# Altium project Clock_PCB.PrjPcb
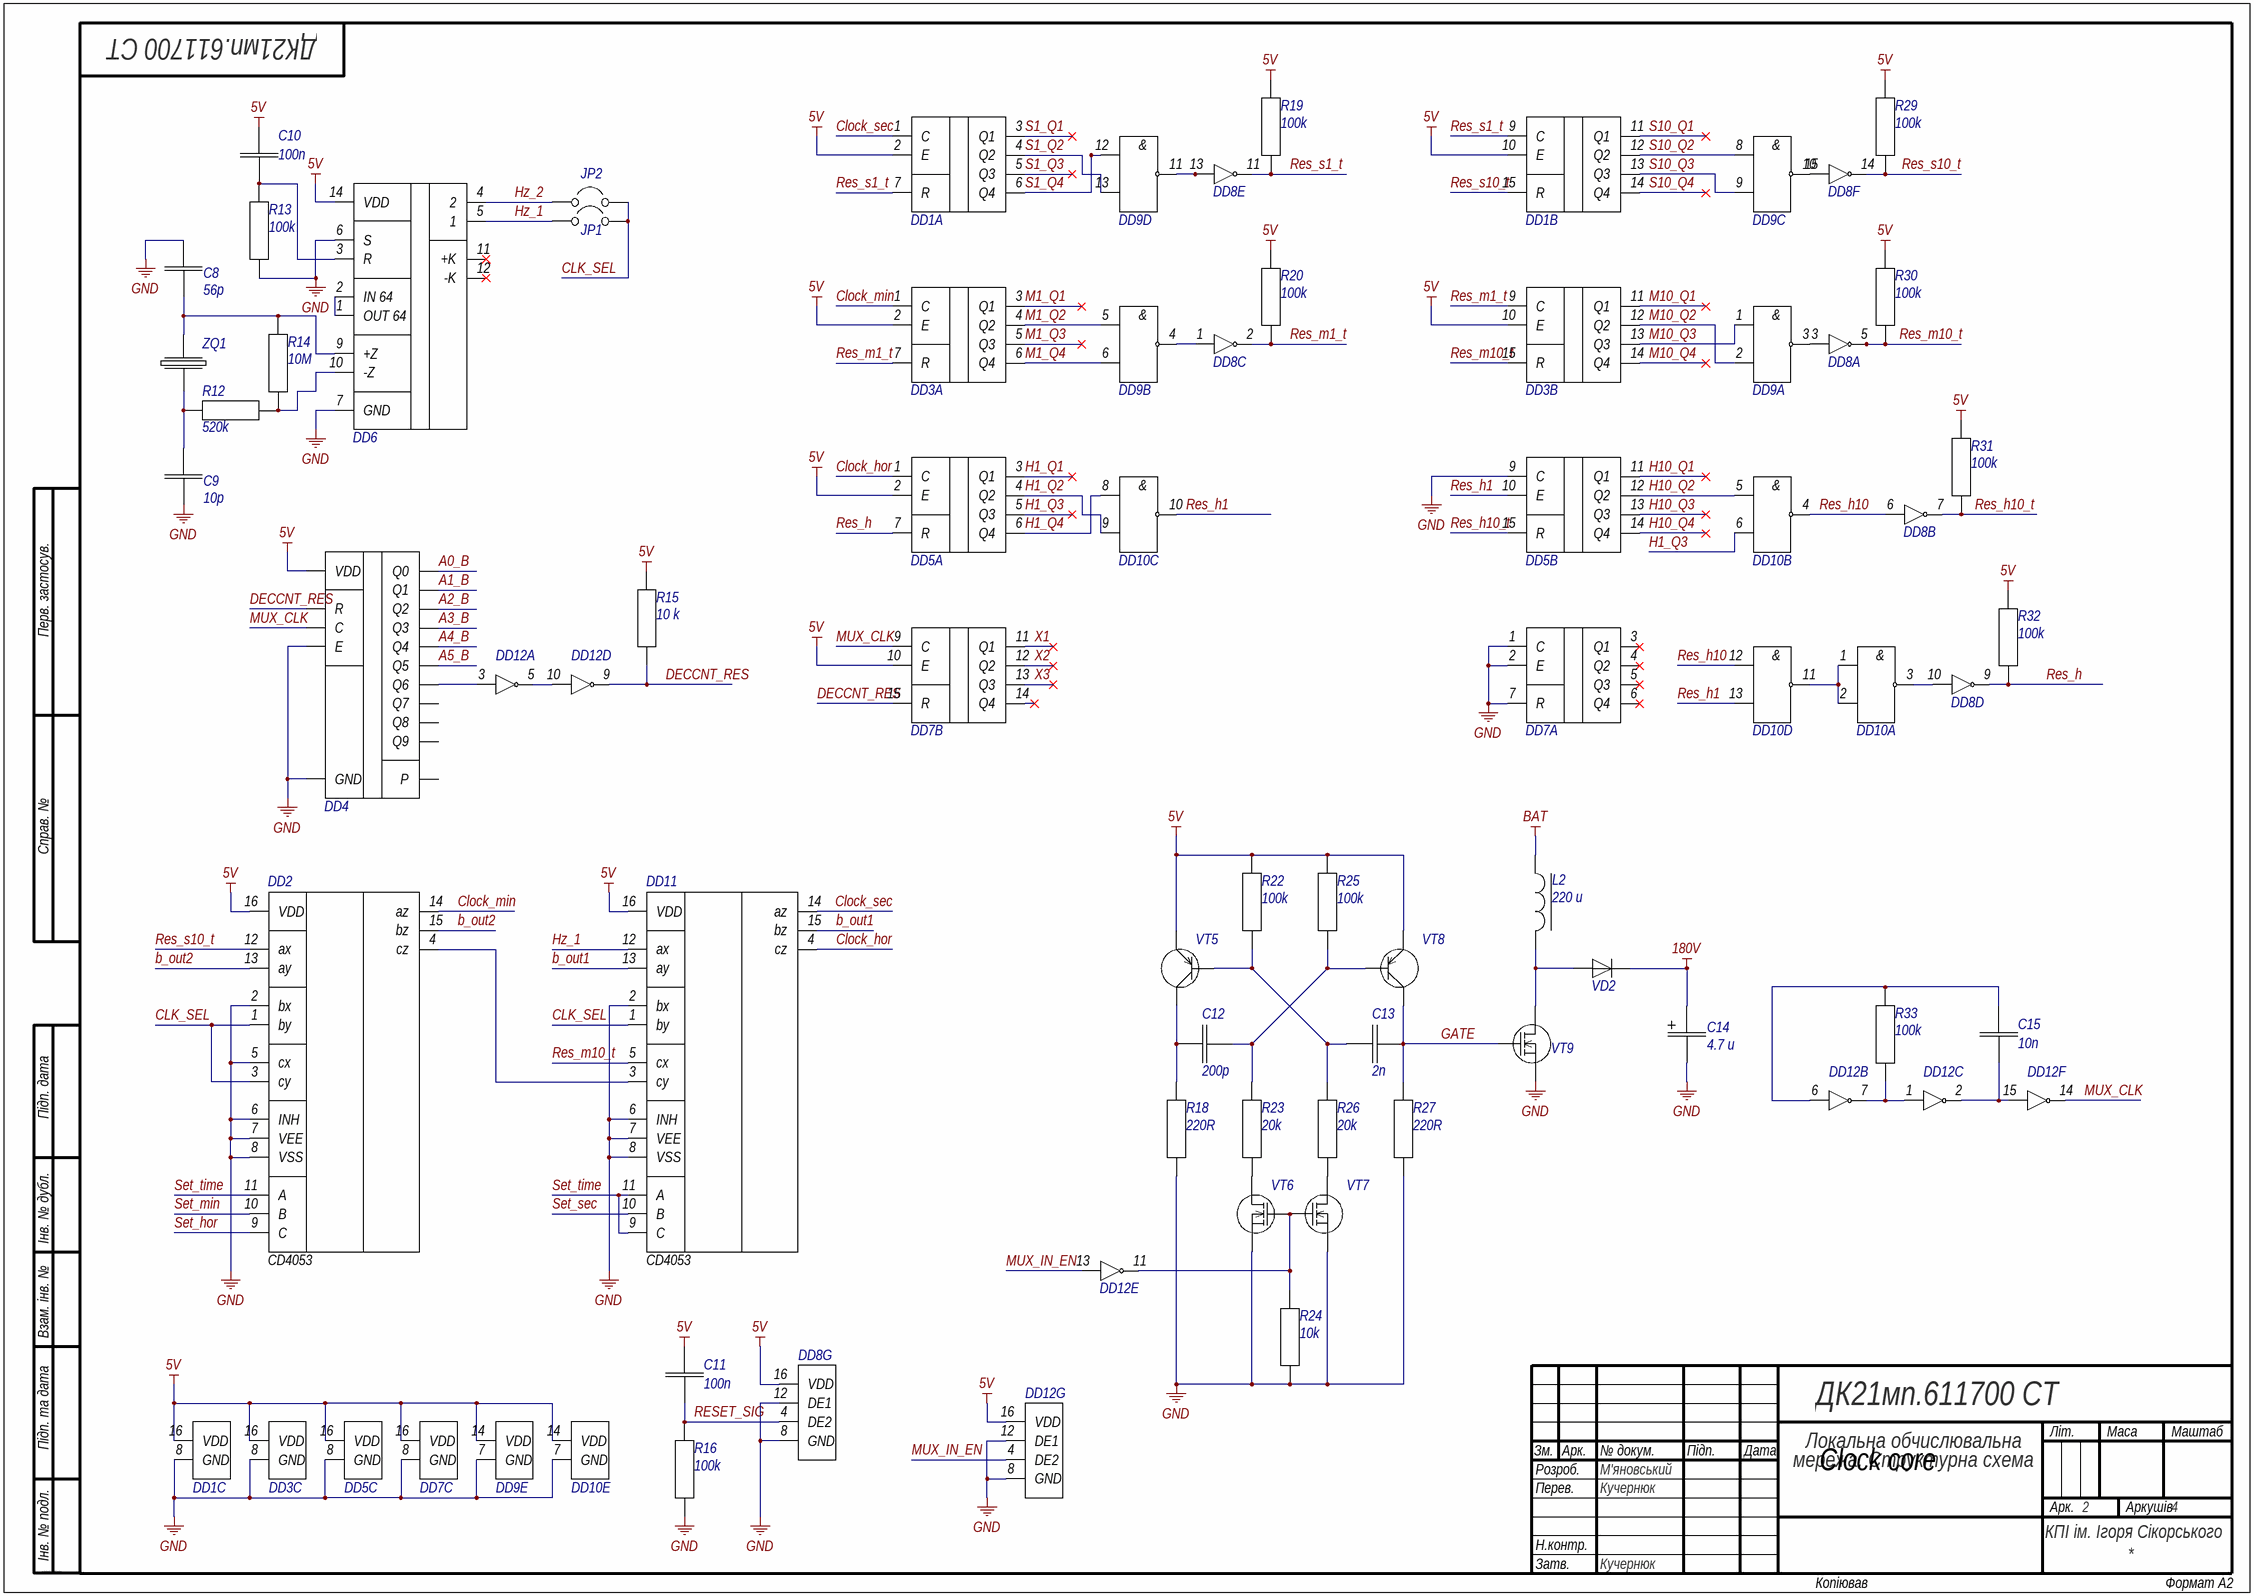
[diagram p0: clock_core.SchDoc]
Наименование: Локальна обчислювальна мережа. Структурна схема; Наименование1: Локальна обчислювальна; Наименование2: мережа. Структурна схема; Обозначение: ДК21мп.611700 СТ; Обозначение_Код: ДК21мп.611700 СТ; п_Пров_Р: Кучернюк; п_Разраб_Р: М'яновський; п_Утв_Р: Кучернюк
4 sheets, 144 parts. Net scope: global (net labels, ports and power ports of the same name join across sheets).
Board file: clock_core_PCB.PcbDoc
Sheets:
  clock_core.SchDoc
  clock_mux.SchDoc
  clock_contr.SchDoc
  clock_pow.SchDoc

## Sheet clock_core.SchDoc
size 594 x 420 mm; SheetNumber: 2; SheetTotal: 4

### Parts
C8  value 56p  [CAP_THT]  (hidden comment: C)
C9  value 10p  [CAP_THT]  (hidden comment: C)
C10  value 100n  [CAP_THT]  (hidden comment: C)
C11  value 100n  [CAP_THT]  (hidden comment: C)
C12  value 200p  [CAP_THT]  (hidden comment: C)
C13  value 2n  [CAP_THT]  (hidden comment: C)
C14  value 4.7 u  [CAP_HIGH_VOLT]  (hidden comment: C+)
C15  value 10n  [CAP_THT]  (hidden comment: C)
DD1  К561ИЕ10  [DIP-16]  (value not drawn)  (parts A,B,C of 3)
DD2  CD4053  [DIP-16]
DD3  К561ИЕ10  [DIP-16]  (value not drawn)  (parts A,B,C of 3)
DD4  К561ИЕ8  [DIP-16]  (value not drawn)
DD5  К561ИЕ10  [DIP-16]  (value not drawn)  (parts A,B,C of 3)
DD6  К176ИЕ5  [DIP-14]  (value not drawn)
DD7  К561ИЕ10  [DIP-16]  (value not drawn)  (parts A,B,C of 3)
DD8  К561ЛН1  [DIP-16]  (value not drawn)  (parts A,B,C,D,E,F,G of 7)
DD9  К561ЛА7  [DIP-14]  (value not drawn)  (parts A,B,C,D,E of 5)
DD10  К561ЛА7  [DIP-14]  (value not drawn)  (parts A,B,C,D,E of 5)
DD11  CD4053  [DIP-16]
DD12  К561ЛН1  [DIP-16]  (value not drawn)  (parts A,B,C,D,E,F,G of 7)
JP1  Jumper  [JP]  (value not drawn)  (no BOM)
JP2  Jumper  [JP]  (value not drawn)  (no BOM)
L2  value 220 u  [IND]  (hidden comment: L)
R12  value 520k  [RES-DIP-V]  (hidden comment: R)
R13  value 100k  [RES-DIP]  (hidden comment: R)
R14  value 10M  [RES-DIP-V]  (hidden comment: R)
R15  value 10 k  [RES-DIP]  (hidden comment: R)
R16  value 100k  [RES-DIP]  (hidden comment: R)
R18  value 220R  [RES-DIP-V]  (hidden comment: R)
R19  value 100k  [RES-DIP]  (hidden comment: R)
R20  value 100k  [RES-DIP]  (hidden comment: R)
R22  value 100k  [RES-DIP-V]  (hidden comment: R)
R23  value 20k  [RES-DIP-V]  (hidden comment: R)
R24  value 10k  [RES-DIP]  (hidden comment: R)
R25  value 100k  [RES-DIP-V]  (hidden comment: R)
R26  value 20k  [RES-DIP-V]  (hidden comment: R)
R27  value 220R  [RES-DIP-V]  (hidden comment: R)
R29  value 100k  [RES-DIP]  (hidden comment: R)
R30  value 100k  [RES-DIP]  (hidden comment: R)
R31  value 100k  [RES-DIP]  (hidden comment: R)
R32  value 100k  [RES-DIP]  (hidden comment: R)
R33  value 100k  [RES-DIP]  (hidden comment: R)
VD2  1N4148  [1N4148]  (value not drawn)
VT5  BC327  [BC327]  (value not drawn)
VT6  2N7000  [2N7000]  (value not drawn)
VT7  2N7000  [2N7000]  (value not drawn)
VT8  BC327  [BC327]  (value not drawn)
VT9  IRF840  [IRF840]  (value not drawn)
ZQ1  HZ  [HZ]  (value not drawn)

### Nets
5V: C10.2 C11.2 DD1.2(E) DD1.10(E) DD1.16(VDD) DD2.16(VDD) DD3.2(E) DD3.10(E) DD3.16(VDD) DD4.16(VDD) DD5.2(E) DD5.16(VDD) DD6.14(VDD) DD7.10(E) DD7.16(VDD) DD8.16(VDD) DD9.14(VDD) DD10.14(VDD) DD11.16(VDD) DD12.16(VDD) R15.2 R19.2 R20.2 R22.2 R25.2 R29.2 R30.2 R31.1 R32.2 VT5.3(E) VT8.3(E)
180V: C14.1 VD2.1(K)
BAT: L2.1
GND: C8.2 C9.1 C14.2 DD1.8(GND) DD2.2(bx) DD2.5(cx) DD2.6(INH) DD2.7(VEE) DD2.8(VSS) DD3.8(GND) DD4.8(GND) DD4.13(E) DD5.8(GND) DD5.9(C) DD6.6(S) DD6.7(GND) DD7.1(C) DD7.2(E) DD7.7(R) DD7.8(GND) DD8.8(GND) DD8.12(DE1) DD9.7(GND) DD10.7(GND) DD11.2(bx) DD11.6(INH) DD11.7(VEE) DD11.8(VSS) DD12.8(GND) DD12.12(DE1) R13.1 R16.1 R18.1 R24.1 R27.1 VT6.1(S) VT7.1(S) VT9.3(S)
A0_B: DD4.3(Q0)
A1_B: DD4.2(Q1)
A2_B: DD4.4(Q2)
A3_B: DD4.7(Q3)
A4_B: DD4.10(Q4)
A5_B: DD4.1(Q5)
b_out1: DD11.13(ay) DD11.15(bz)
b_out2: DD2.13(ay) DD2.15(bz)
CLK_SEL: DD2.1(by) DD2.3(cy) DD11.1(by) JP1.2 JP2.2
Clock_hor: DD5.1(C) DD11.4(cz)
Clock_min: DD2.14(az) DD3.1(C)
Clock_sec: DD1.1(C) DD11.14(az)
DECCNT_RES: DD4.15(R) DD7.15(R) DD12.9(OUT4) R15.1
GATE: C13.2 R27.2 VT8.1(C) VT9.1(G)
H1_Q1: DD5.3(Q1)
H1_Q2: DD5.4(Q2) DD10.9
H1_Q3: DD5.5(Q3) DD10.6
H1_Q4: DD5.6(Q4) DD10.8
H10_Q1: DD5.11(Q1)
H10_Q2: DD5.12(Q2) DD10.5
H10_Q3: DD5.13(Q3)
H10_Q4: DD5.14(Q4)
Hz_1: DD6.5(1) DD11.12(ax) JP1.1
Hz_2: DD6.4(2) JP2.1
M1_Q1: DD3.3(Q1)
M1_Q2: DD3.4(Q2) DD9.5
M1_Q3: DD3.5(Q3)
M1_Q4: DD3.6(Q4) DD9.6
M10_Q1: DD3.11(Q1)
M10_Q2: DD3.12(Q2) DD9.2
M10_Q3: DD3.13(Q3) DD9.1
M10_Q4: DD3.14(Q4)
MUX_CLK: DD4.14(C) DD7.9(C) DD12.14(OUT6)
MUX_IN_EN: DD12.4(DE2) DD12.13(IN5)
Res_h: DD5.7(R) DD8.9(OUT4) R32.1
Res_h1: DD5.10(E) DD10.10 DD10.13
Res_h10: DD8.6(IN2) DD10.4 DD10.12
Res_h10_t: DD5.15(R) DD8.7(OUT2) R31.2
Res_m1_t: DD3.7(R) DD3.9(C) DD8.2(OUT3) R20.1
Res_m10_t: DD3.15(R) DD8.5(OUT1) DD11.5(cx) R30.1
Res_s1_t: DD1.7(R) DD1.9(C) DD8.11(OUT5) R19.1
Res_s10_t: DD1.15(R) DD2.12(ax) DD8.14(OUT6) R29.1
RESET_SIG: C11.1 DD8.4(DE2) R16.2
S1_Q1: DD1.3(Q1)
S1_Q2: DD1.4(Q2) DD9.13
S1_Q3: DD1.5(Q3)
S1_Q4: DD1.6(Q4) DD9.12
S10_Q1: DD1.11(Q1)
S10_Q2: DD1.12(Q2) DD9.8
S10_Q3: DD1.13(Q3) DD9.9
S10_Q4: DD1.14(Q4)
Set_hor: DD2.9(C)
Set_min: DD2.10(B)
Set_sec: DD11.10(B)
Set_time: DD2.11(A) DD11.9(C) DD11.11(A)
X1: DD7.11(Q1)
X2: DD7.12(Q2)
X3: DD7.13(Q3)
NetC8_1: C8.1 DD6.9(+Z) R14.2 ZQ1.2
NetC9_2: C9.2 R12.1 ZQ1.1
NetC10_1: C10.1 DD6.3(R) R13.2
NetC12_1: C12.1 R18.2 VT5.1(C)
NetC12_2: C12.2 R23.2 R25.1 VT8.2(B)
NetC13_1: C13.1 R22.1 R26.2 VT5.2(B)
NetC15_1: C15.1 DD12.6(IN2) R33.2
NetC15_2: C15.2 DD12.2(OUT3) DD12.15(IN6)
NetDD2_4: DD2.4(cz) DD11.3(cy)
NetDD4_5: DD4.5(Q6) DD12.3(IN1)
NetDD6_1: DD6.1(OUT_64) DD6.2(IN_64)
NetDD6_10: DD6.10(-Z) R12.2 R14.1
NetDD8_1: DD8.1(IN3) DD9.4
NetDD8_3: DD8.3(IN1) DD9.3
NetDD8_10: DD8.10(IN4) DD10.3
NetDD8_13: DD8.13(IN5) DD9.11
NetDD8_15: DD8.15(IN6) DD9.10
NetDD10_1: DD10.1 DD10.2 DD10.11
NetDD12_1: DD12.1(IN3) DD12.7(OUT2) R33.1
NetDD12_5: DD12.5(OUT1) DD12.10(IN4)
NetDD12_11: DD12.11(OUT5) R24.2 VT6.2(G) VT7.2(G)
NetL2_2: L2.2 VD2.2(A) VT9.2(D)
NetR23_1: R23.1 VT6.3(D)
NetR26_1: R26.1 VT7.3(D)

Not connected (* = marked no-connect by the designer): DD4 6(Q7) 9(Q8) 11(Q9) 12(P); DD6 11(+K)* 12(-K)*; DD7 3(Q1)* 4(Q2)* 5(Q3)* 6(Q4)* 14(Q4)*

### Notes on the sheet
- Clock core
- Перв. застосув.
- Справ. №
- Підп. дата
- Інв. № дубл.
- Взам. інв. №
- Підп. та дата
- Зм.
- Розроб.
- Арк.
- № докум.
- Підп.
- Дата
- Літ.
- Маса
- Маштаб
- Перев.
- Аркушів
- Інв. № подл.
- Н.контр.
- Затв.
- КПІ ім. Ігоря Сікорського
- ALTIUM GOSTBOM2.0 KEV
- Копіював
- Формат А2
- (in symbol К561ЛА7, part A) &
- (in symbol К561ЛА7, part B) &
- (in symbol К561ЛА7, part C) &
- (in symbol К561ЛА7, part D) &

### Library data of the parts
DD2 DD11 = CD4053: Name: CD4053

## Sheet clock_mux.SchDoc
size 594 x 420 mm; SheetNumber: 3; SheetTotal: 4
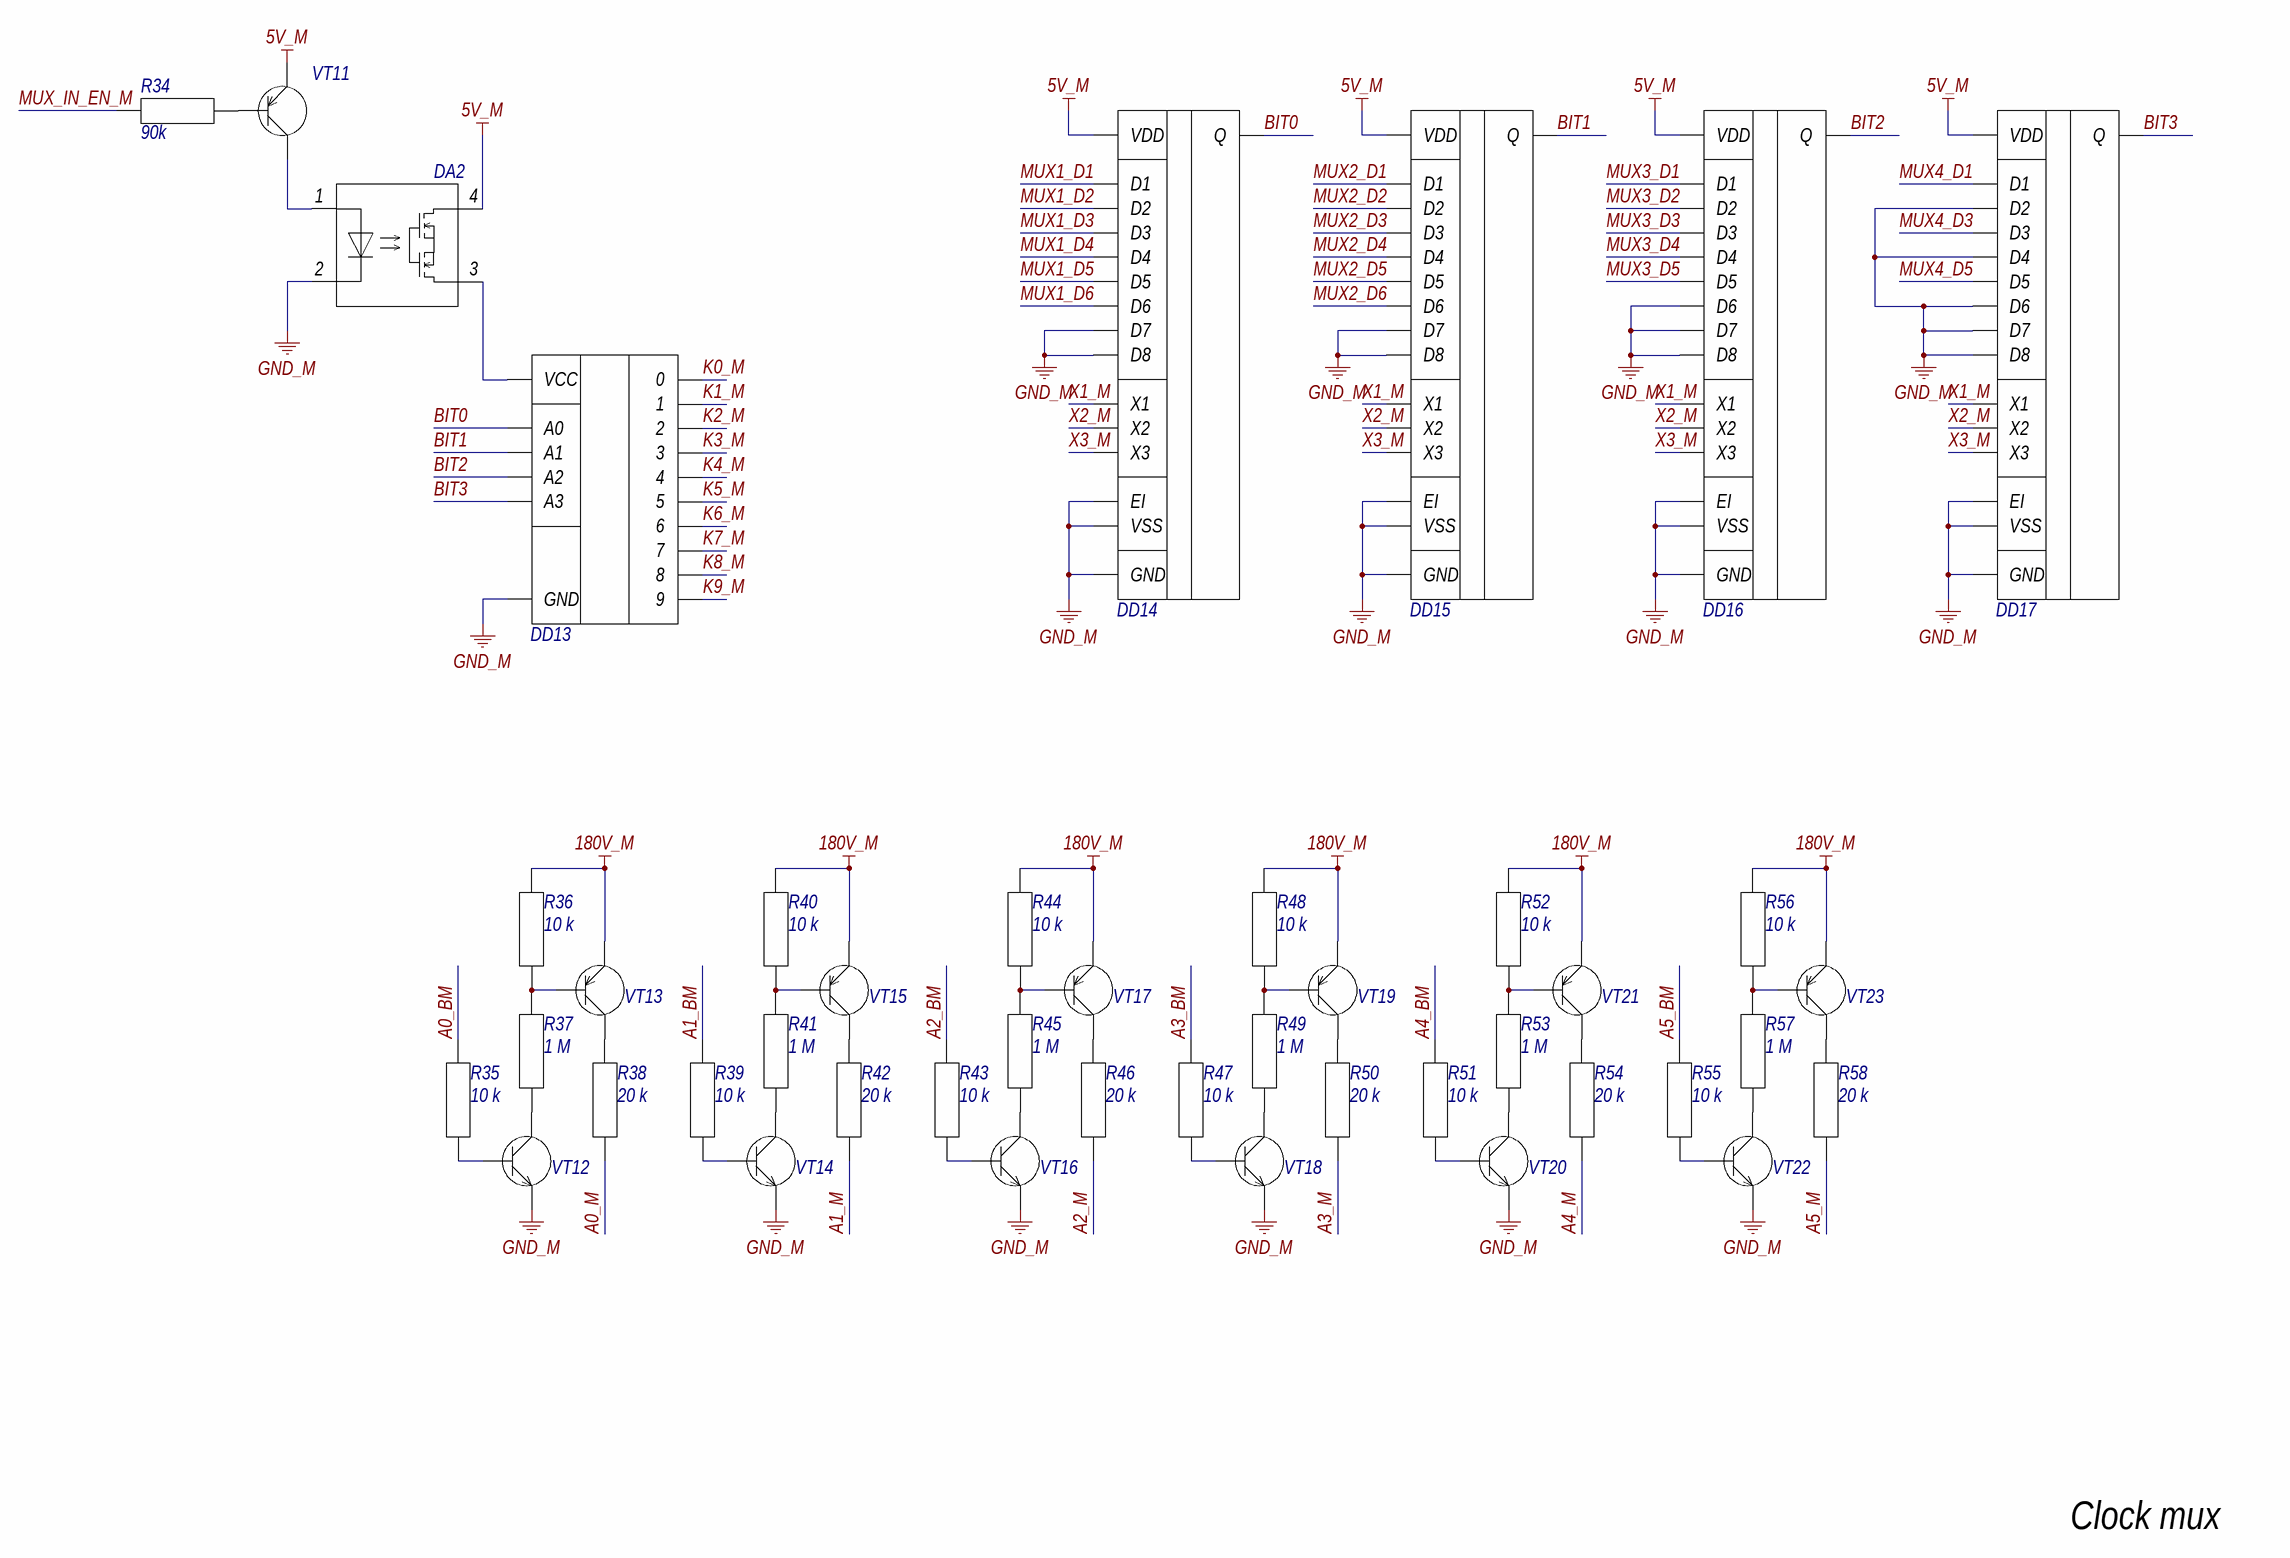
[diagram p1: clock_mux.SchDoc]

### Parts
DA2  CPC1008NTR  [CPC1008NTR]  (value not drawn)
DD13  К155ИД1  [DIP-16]  (value not drawn)
DD14  К561КП2  [DIP-16]  (value not drawn)
DD15  К561КП2  [DIP-16]  (value not drawn)
DD16  К561КП2  [DIP-16]  (value not drawn)
DD17  К561КП2  [DIP-16]  (value not drawn)
R34  value 90k  [RES-DIP]  (hidden comment: R)
R35  value 10 k  [RES-DIP-V]  (hidden comment: R)
R36  value 10 k  [RES-DIP-V]  (hidden comment: R)
R37  value 1 M  [RES-DIP-V]  (hidden comment: R)
R38  value 20 k  [RES-DIP-V]  (hidden comment: R)
R39  value 10 k  [RES-DIP-V]  (hidden comment: R)
R40  value 10 k  [RES-DIP-V]  (hidden comment: R)
R41  value 1 M  [RES-DIP-V]  (hidden comment: R)
R42  value 20 k  [RES-DIP-V]  (hidden comment: R)
R43  value 10 k  [RES-DIP-V]  (hidden comment: R)
R44  value 10 k  [RES-DIP-V]  (hidden comment: R)
R45  value 1 M  [RES-DIP-V]  (hidden comment: R)
R46  value 20 k  [RES-DIP-V]  (hidden comment: R)
R47  value 10 k  [RES-DIP-V]  (hidden comment: R)
R48  value 10 k  [RES-DIP-V]  (hidden comment: R)
R49  value 1 M  [RES-DIP-V]  (hidden comment: R)
R50  value 20 k  [RES-DIP-V]  (hidden comment: R)
R51  value 10 k  [RES-DIP-V]  (hidden comment: R)
R52  value 10 k  [RES-DIP-V]  (hidden comment: R)
R53  value 1 M  [RES-DIP-V]  (hidden comment: R)
R54  value 20 k  [RES-DIP-V]  (hidden comment: R)
R55  value 10 k  [RES-DIP-V]  (hidden comment: R)
R56  value 10 k  [RES-DIP-V]  (hidden comment: R)
R57  value 1 M  [RES-DIP-V]  (hidden comment: R)
R58  value 20 k  [RES-DIP-V]  (hidden comment: R)
VT11  BC327  [BC327]  (value not drawn)
VT12  2N5551  [2N5551]  (value not drawn)
VT13  2N5401  [2N5401]  (value not drawn)
VT14  2N5551  [2N5551]  (value not drawn)
VT15  2N5401  [2N5401]  (value not drawn)
VT16  2N5551  [2N5551]  (value not drawn)
VT17  2N5401  [2N5401]  (value not drawn)
VT18  2N5551  [2N5551]  (value not drawn)
VT19  2N5401  [2N5401]  (value not drawn)
VT20  2N5551  [2N5551]  (value not drawn)
VT21  2N5401  [2N5401]  (value not drawn)
VT22  2N5551  [2N5551]  (value not drawn)
VT23  2N5401  [2N5401]  (value not drawn)

### Nets
5V_M: DA2.4 DD14.16(VDD) DD15.16(VDD) DD16.16(VDD) DD17.16(VDD) VT11.3(E)
180V_M: R36.2 R40.2 R44.2 R48.2 R52.2 R56.2 VT13.1(E) VT15.1(E) VT17.1(E) VT19.1(E) VT21.1(E) VT23.1(E)
GND_M: DA2.2 DD13.12(GND) DD14.2(D7) DD14.4(D8) DD14.6(EI) DD14.7(VSS) DD14.8(GND) DD15.2(D7) DD15.4(D8) DD15.6(EI) DD15.7(VSS) DD15.8(GND) DD16.2(D7) DD16.4(D8) DD16.5(D6) DD16.6(EI) DD16.7(VSS) DD16.8(GND) DD17.2(D7) DD17.4(D8) DD17.5(D6) DD17.6(EI) DD17.7(VSS) DD17.8(GND) DD17.12(D4) DD17.14(D2) VT12.1(E) VT14.1(E) VT16.1(E) VT18.1(E) VT20.1(E) VT22.1(E)
A0_BM: R35.1
A0_M: R38.1
A1_BM: R39.1
A1_M: R42.1
A2_BM: R43.1
A2_M: R46.1
A3_BM: R47.1
A3_M: R50.1
A4_BM: R51.1
A4_M: R54.1
A5_BM: R55.1
A5_M: R58.1
BIT0: DD13.3(A0) DD14.3(Q)
BIT1: DD13.6(A1) DD15.3(Q)
BIT2: DD13.7(A2) DD16.3(Q)
BIT3: DD13.4(A3) DD17.3(Q)
K0_M: DD13.16(0)
K1_M: DD13.15(1)
K2_M: DD13.8(2)
K3_M: DD13.9(3)
K4_M: DD13.13(4)
K5_M: DD13.14(5)
K6_M: DD13.11(6)
K7_M: DD13.10(7)
K8_M: DD13.1(8)
K9_M: DD13.2(9)
MUX1_D1: DD14.13(D1)
MUX1_D2: DD14.14(D2)
MUX1_D3: DD14.15(D3)
MUX1_D4: DD14.12(D4)
MUX1_D5: DD14.1(D5)
MUX1_D6: DD14.5(D6)
MUX2_D1: DD15.13(D1)
MUX2_D2: DD15.14(D2)
MUX2_D3: DD15.15(D3)
MUX2_D4: DD15.12(D4)
MUX2_D5: DD15.1(D5)
MUX2_D6: DD15.5(D6)
MUX3_D1: DD16.13(D1)
MUX3_D2: DD16.14(D2)
MUX3_D3: DD16.15(D3)
MUX3_D4: DD16.12(D4)
MUX3_D5: DD16.1(D5)
MUX4_D1: DD17.13(D1)
MUX4_D3: DD17.15(D3)
MUX4_D5: DD17.1(D5)
MUX_IN_EN_M: R34.1
X1_M: DD14.11(X1) DD15.11(X1) DD16.11(X1) DD17.11(X1)
X2_M: DD14.10(X2) DD15.10(X2) DD16.10(X2) DD17.10(X2)
X3_M: DD14.9(X3) DD15.9(X3) DD16.9(X3) DD17.9(X3)
NetDA2_1: DA2.1 VT11.1(C)
NetDA2_3: DA2.3 DD13.5(VCC)
NetR34_2: R34.2 VT11.2(B)
NetR35_2: R35.2 VT12.2(B)
NetR36_1: R36.1 R37.2 VT13.2(B)
NetR37_1: R37.1 VT12.3(C)
NetR38_2: R38.2 VT13.3(C)
NetR39_2: R39.2 VT14.2(B)
NetR40_1: R40.1 R41.2 VT15.2(B)
NetR41_1: R41.1 VT14.3(C)
NetR42_2: R42.2 VT15.3(C)
NetR43_2: R43.2 VT16.2(B)
NetR44_1: R44.1 R45.2 VT17.2(B)
NetR45_1: R45.1 VT16.3(C)
NetR46_2: R46.2 VT17.3(C)
NetR47_2: R47.2 VT18.2(B)
NetR48_1: R48.1 R49.2 VT19.2(B)
NetR49_1: R49.1 VT18.3(C)
NetR50_2: R50.2 VT19.3(C)
NetR51_2: R51.2 VT20.2(B)
NetR52_1: R52.1 R53.2 VT21.2(B)
NetR53_1: R53.1 VT20.3(C)
NetR54_2: R54.2 VT21.3(C)
NetR55_2: R55.2 VT22.2(B)
NetR56_1: R56.1 R57.2 VT23.2(B)
NetR57_1: R57.1 VT22.3(C)
NetR58_2: R58.2 VT23.3(C)

### Notes on the sheet
- Clock mux
- Перв. застосув.
- Справ. №
- Підп. дата
- Інв. № дубл.
- Взам. інв. №
- Підп. та дата
- Зм.
- Розроб.
- Арк.
- № докум.
- Підп.
- Дата
- Літ.
- Маса
- Маштаб
- Перев.
- Аркушів
- Інв. № подл.
- Н.контр.
- Затв.
- КПІ ім. Ігоря Сікорського
- ALTIUM GOSTBOM2.0 KEV
- Копіював
- Формат А2

### Library data of the parts
DA2 = CPC1008NTR: Name: CPC1008NTR

## Sheet clock_contr.SchDoc
size 594 x 420 mm; SheetNumber: 1; SheetTotal: 4
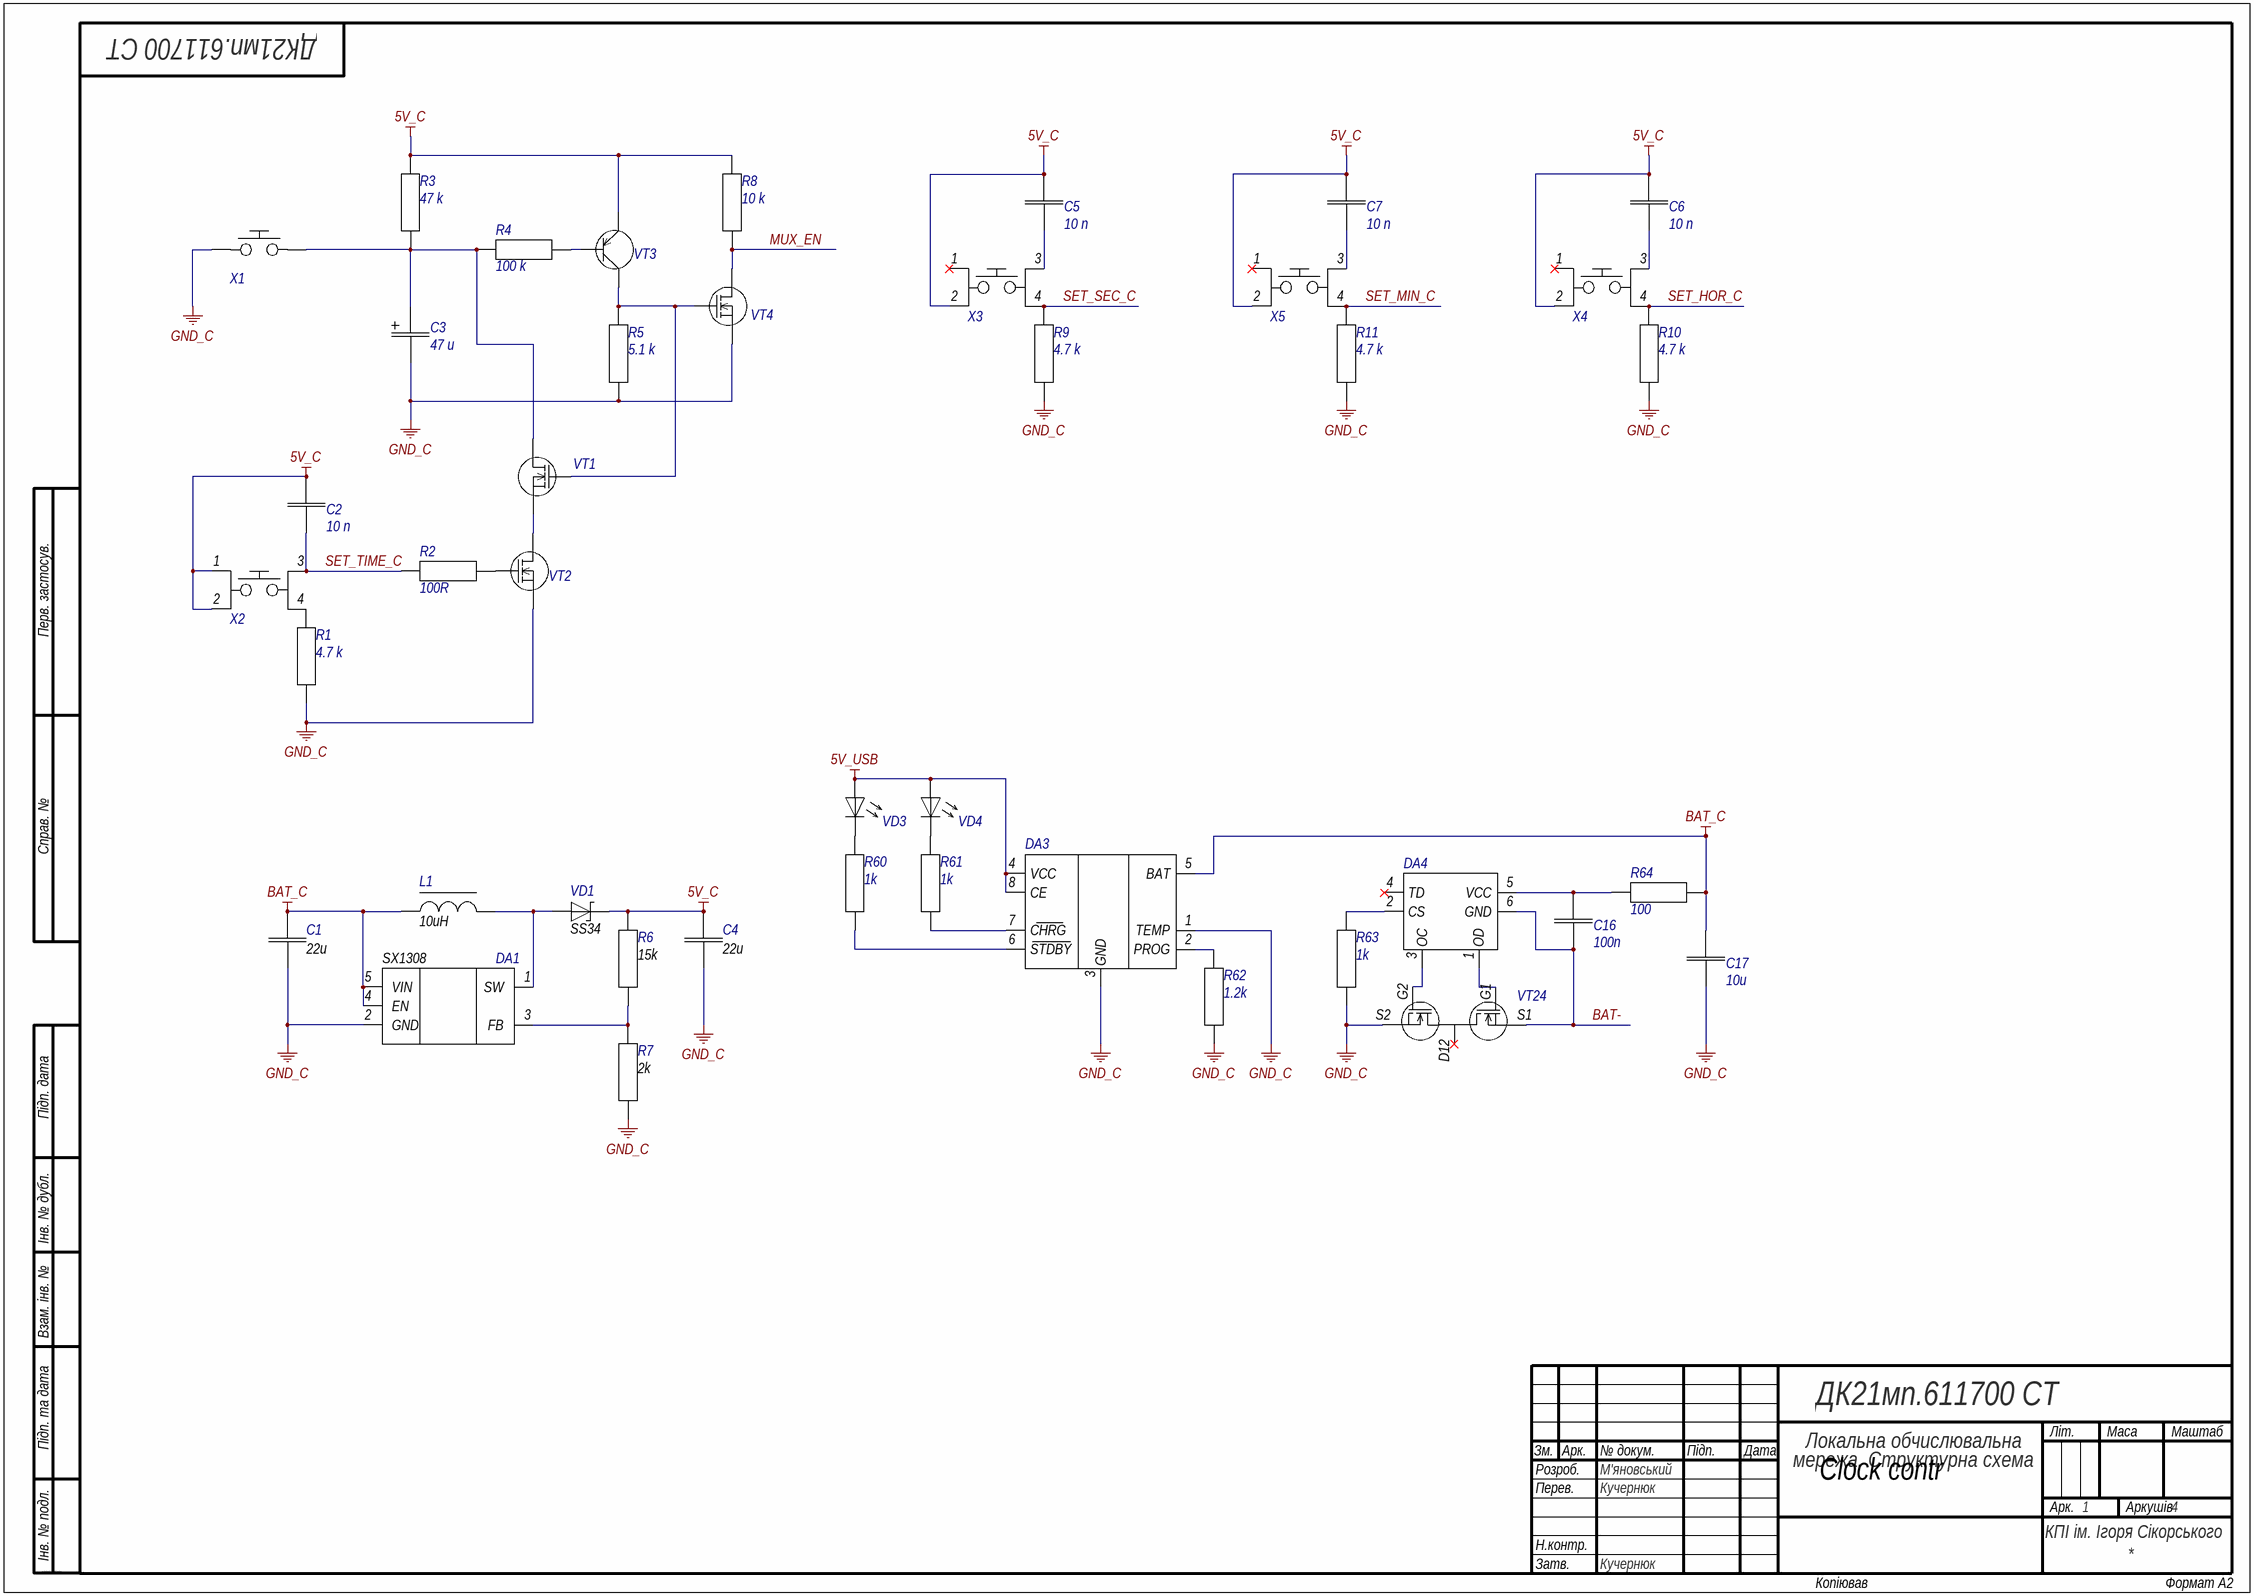
[diagram p2: clock_contr.SchDoc]

### Parts
C1  value 22u  [CAP0805]  (hidden comment: C0805)
C2  value 10 n  [CAP_THT]  (hidden comment: C)
C3  value 47 u  [CAP_POL]  (hidden comment: C+)
C4  value 22u  [CAP0805]  (hidden comment: C0805)
C5  value 10 n  [CAP_THT]  (hidden comment: C)
C6  value 10 n  [CAP_THT]  (hidden comment: C)
C7  value 10 n  [CAP_THT]  (hidden comment: C)
C16  value 100n  [CAP0805]  (hidden comment: C)
C17  value 10u  [CAP0805]  (hidden comment: C)
DA1  SX1308  [SOT23-6]
DA3  TP4056  [SOIC-8]  (value not drawn)
DA4  DW01A  [SOT23-6]  (value not drawn)
L1  value 10uH  [L_SMD]  (hidden comment: L)
R1  value 4.7 k  [RES-DIP]  (hidden comment: R)
R2  value 100R  [RES-DIP]  (hidden comment: R)
R3  value 47 k  [RES-DIP]  (hidden comment: R)
R4  value 100 k  [RES-DIP]  (hidden comment: R)
R5  value 5.1 k  [RES-DIP]  (hidden comment: R)
R6  value 15k  [RES0805]  (hidden comment: R0805)
R7  value 2k  [RES0805]  (hidden comment: R0805)
R8  value 10 k  [RES-DIP]  (hidden comment: R)
R9  value 4.7 k  [RES-DIP]  (hidden comment: R)
R10  value 4.7 k  [RES-DIP]  (hidden comment: R)
R11  value 4.7 k  [RES-DIP]  (hidden comment: R)
R60  value 1k  [RES0805]  (hidden comment: R)
R61  value 1k  [RES0805]  (hidden comment: R)
R62  value 1.2k  [RES0805]  (hidden comment: R)
R63  value 1k  [RES0805]  (hidden comment: R)
R64  value 100  [RES0805]  (hidden comment: R)
VD1  SS34  [DIOM4634X26N]
VD3  LED  [LED_RED]  (value not drawn)
VD4  LED  [LED_RED]  (value not drawn)
VT1  2N7000  [2N7000]  (value not drawn)
VT2  2N7000  [2N7000]  (value not drawn)
VT3  BC327  [BC327]  (value not drawn)
VT4  2N7000  [2N7000]  (value not drawn)
VT24  FS8205 Fortune  [TSSOP8]  (value not drawn)
X1  wake_up_button  [WAKE-UP-BUTTON]  (value not drawn)
X2  button  [button]  (value not drawn)
X3  button  [button]  (value not drawn)
X4  button  [button]  (value not drawn)
X5  button  [button]  (value not drawn)

### Nets
5V_C: C2.2 C4.2 C5.2 C6.2 C7.2 R3.2 R6.2 R8.2 VD1.1(K) VT3.3(E) X2.1 X2.2 X3.2 X4.2 X5.2
5V_USB: DA3.4(VCC) DA3.8(CE) VD3.2(A) VD4.2(A)
BAT_C: C1.2 C17.2 DA1.4(EN) DA1.5(VIN) DA3.5(BAT) L1.1 R64.2
GND_C: C1.1 C3.2 C4.1 C17.1 DA1.2(GND) DA3.1(TEMP) DA3.3(GND) R1.1 R5.1 R7.1 R9.1 R10.1 R11.1 R62.1 R63.1 VT2.1(S) VT4.1(S) VT24.S2 X1.1
BAT-: C16.1 DA4.6(GND) VT24.S1
MUX_EN: R8.1 VT4.3(D)
SET_HOR_C: R10.2 X4.4
SET_MIN_C: R11.2 X5.4
SET_SEC_C: R9.2 X3.4
SET_TIME_C: C2.1 R2.1 X2.3
NetC3_1: C3.1 R3.1 R4.1 VT1.3(D) X1.2
NetC5_1: C5.1 X3.3
NetC6_1: C6.1 X4.3
NetC7_1: C7.1 X5.3
NetC16_2: C16.2 DA4.5(VCC) R64.1
NetDA1_1: DA1.1(SW) L1.2 VD1.2(A)
NetDA1_3: DA1.3(FB) R6.1 R7.2
NetDA3_2: DA3.2(PROG) R62.2
NetDA3_6: DA3.6(STDBY) R60.2
NetDA3_7: DA3.7(CHRG) R61.2
NetDA4_1: DA4.1(OD) VT24.G1
NetDA4_2: DA4.2(CS) R63.2
NetDA4_3: DA4.3(OC) VT24.G2
NetR1_2: R1.2 X2.4
NetR2_2: R2.2 VT2.2(G)
NetR4_2: R4.2 VT3.2(B)
NetR5_2: R5.2 VT1.2(G) VT3.1(C) VT4.2(G)
NetR60_1: R60.1 VD3.1(K)
NetR61_1: R61.1 VD4.1(K)
NetVT1_1: VT1.1(S) VT2.3(D)
NetVT24_5: VT24.5(D12) VT24.D12

Not connected (* = marked no-connect by the designer): DA4 4(TD)*; X3 1*; X4 1*; X5 1*

### Notes on the sheet
- Clock contr
- Перв. застосув.
- Справ. №
- Підп. дата
- Інв. № дубл.
- Взам. інв. №
- Підп. та дата
- Зм.
- Розроб.
- Арк.
- № докум.
- Підп.
- Дата
- Літ.
- Маса
- Маштаб
- Перев.
- Аркушів
- Інв. № подл.
- Н.контр.
- Затв.
- КПІ ім. Ігоря Сікорського
- ALTIUM GOSTBOM2.0 KEV
- Копіював
- Формат А2

### Library data of the parts
VT24 = FS8205: Manufacturer: Fortune; ComponentLink1Description: Datasheet; ComponentLink1URL: https://datasheet.lcsc.com/szlcsc/Fortune-Semicon-FS8205_C32254.pdf; Part Number: FS8205; Value: FS8205
DA1 = SX1308: Name: SX1308
VD1 = SS34: Name: SS34

## Sheet clock_pow.SchDoc
size 594 x 420 mm; SheetNumber: 4; SheetTotal: 4
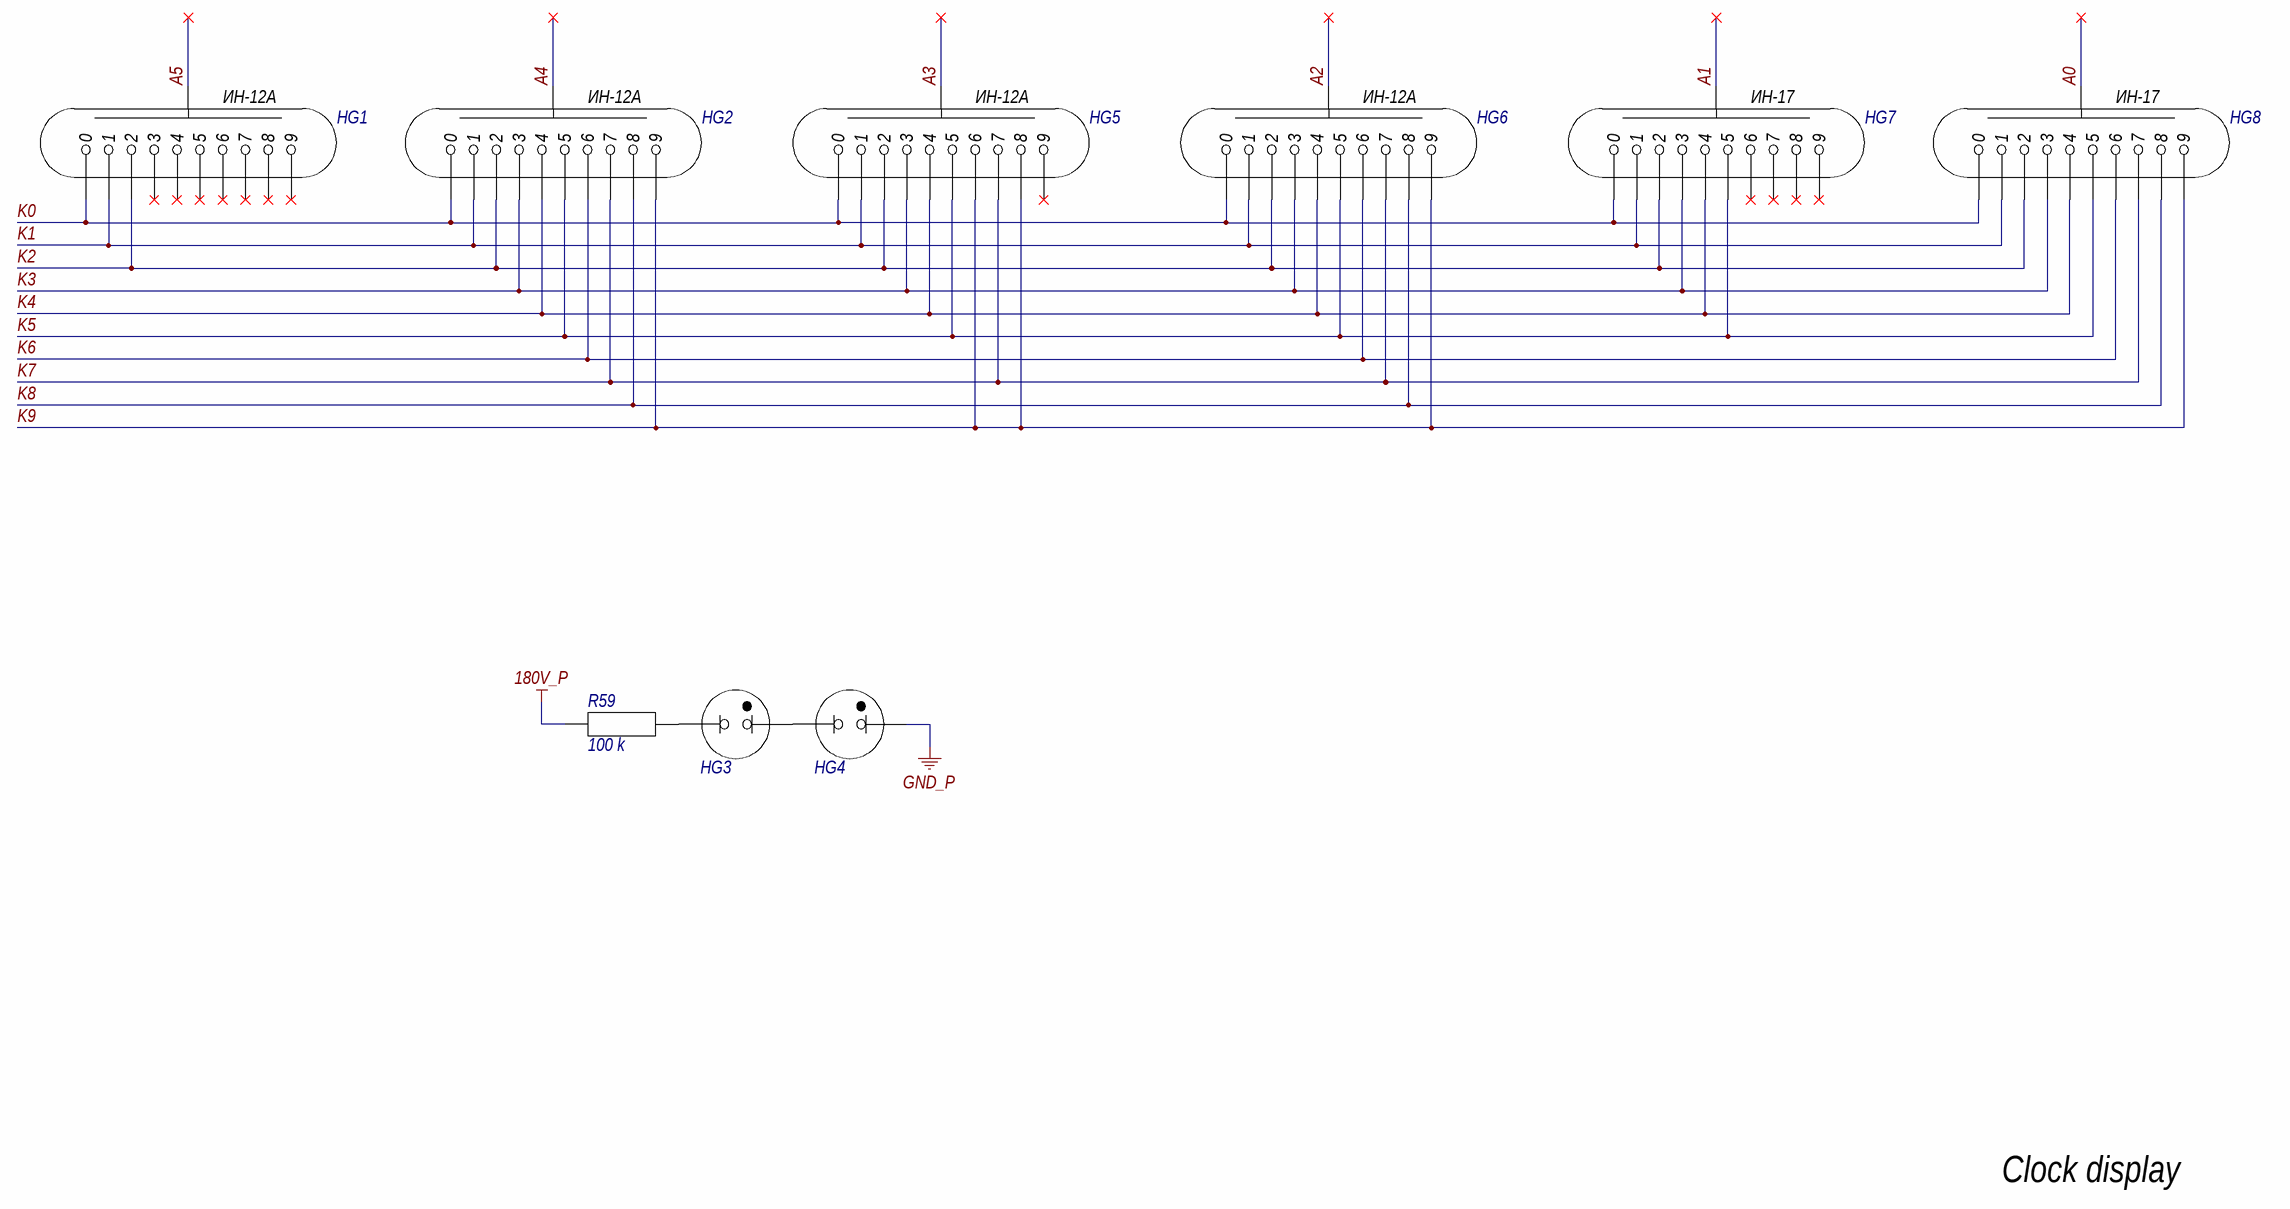
[diagram p3: clock_pow.SchDoc]

### Parts
HG1  ИН-12  [IN-12-NO-SOKET]  (value not drawn)
HG2  ИН-12  [IN-12-NO-SOKET]  (value not drawn)
HG3  ИНА_ТН_02  [INA_TN_02]  (value not drawn)
HG4  ИНА_ТН_02  [INA_TN_02]  (value not drawn)
HG5  ИН-12  [IN-12-NO-SOKET]  (value not drawn)
HG6  ИН-12  [IN-12-NO-SOKET]  (value not drawn)
HG7  ИН-17  [IN-17]  (value not drawn)
HG8  ИН-17  [IN-17]  (value not drawn)
R59  value 100 k  [RES-DIP]  (hidden comment: R)

### Nets
180V_P: R59.1
GND_P: HG4.2(K)
A0: HG8.1
A1: HG7.1
A2: HG6.1
A3: HG5.1
A4: HG2.1
A5: HG1.1
K0: HG1.2(0) HG2.2(0) HG5.2(0) HG6.2(0) HG7.2(0) HG8.2(0)
K1: HG1.11(1) HG2.11(1) HG5.11(1) HG6.11(1) HG7.3(1) HG8.3(1)
K2: HG1.10(2) HG2.10(2) HG5.10(2) HG6.10(2) HG7.4(2) HG8.4(2)
K3: HG2.9(3) HG5.9(3) HG6.9(3) HG7.5(3) HG8.5(3)
K4: HG2.8(4) HG5.8(4) HG6.8(4) HG7.6(4) HG8.6(4)
K5: HG2.7(5) HG5.7(5) HG6.7(5) HG7.7(5) HG8.7(5)
K6: HG2.6 HG6.6 HG8.8(6)
K7: HG2.5(7) HG5.5(7) HG6.5(7) HG8.9(7)
K8: HG2.4(8) HG6.4(8) HG8.10(8)
K9: HG2.3(9) HG5.4(8) HG5.6 HG6.3(9) HG8.11(9)
NetHG3_1: HG3.1(A) R59.2
NetHG3_2: HG3.2(K) HG4.1(A)

Not connected (* = marked no-connect by the designer): HG1 3(9)* 4(8)* 5(7)* 6* 7(5)* 8(4)* 9(3)*; HG5 3(9)*; HG7 8(6)* 9(7)* 10(8)* 11(9)*

### Notes on the sheet
- Clock display
- Перв. застосув.
- Справ. №
- Підп. дата
- Інв. № дубл.
- Взам. інв. №
- Підп. та дата
- Зм.
- Розроб.
- Арк.
- № докум.
- Підп.
- Дата
- Літ.
- Маса
- Маштаб
- Перев.
- Аркушів
- Інв. № подл.
- Н.контр.
- Затв.
- КПІ ім. Ігоря Сікорського
- ALTIUM GOSTBOM2.0 KEV
- Копіював
- Формат А2
- (in symbol ИН-12) ИН-12А